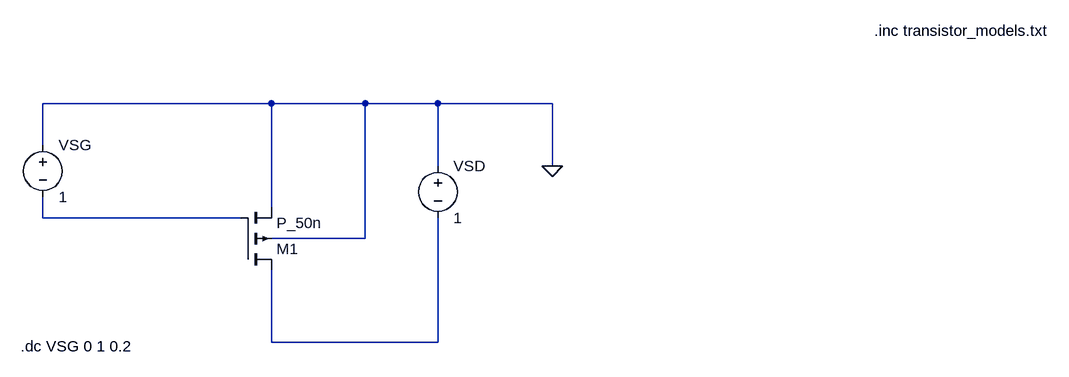
[diagram p0: schematic lab01_pmos1u_characterization.asc]
lab01_pmos1u_characterization.asc, the LTspice schematic file:
Version 4
SHEET 1 1276 680
WIRE 48 -160 -304 -160
WIRE 192 -160 48 -160
WIRE 304 -160 192 -160
WIRE 480 -160 304 -160
WIRE -304 -96 -304 -160
WIRE 304 -64 304 -160
WIRE 480 -64 480 -160
WIRE 48 0 48 -160
WIRE -304 16 -304 -16
WIRE 0 16 -304 16
WIRE 192 48 192 -160
WIRE 192 48 48 48
WIRE 48 208 48 96
WIRE 304 208 304 16
WIRE 304 208 48 208
FLAG 480 -64 0
SYMBOL pmos4 0 96 M180
SYMATTR InstName M1
SYMATTR Value P_50n
SYMATTR Value2 l=50n w=500n
SYMBOL voltage -304 -112 R0
WINDOW 123 0 0 Left 0
WINDOW 39 0 0 Left 0
SYMATTR InstName VSG
SYMATTR Value 1
SYMBOL voltage 304 -80 R0
WINDOW 123 0 0 Left 0
WINDOW 39 0 0 Left 0
SYMATTR InstName VSD
SYMATTR Value 1
TEXT 976 -272 Left 2 !.inc transistor_models.txt
TEXT -338 214 Left 2 !.dc VSG 0 1 0.2

The netlist it stands for:
* lab01_pmos1u_characterization.asc
M1 N002 N001 0 0 P_50n l=50n w=500n
VSG 0 N001 1
VSD 0 N002 1
.model NMOS NMOS
.model PMOS PMOS
.lib standard.mos
.inc transistor_models.txt
.dc VSG 0 1 0.2
.backanno
.end